# EAGLE design panel-mount-orafice-mk-1 (EAGLE 6.5.0)
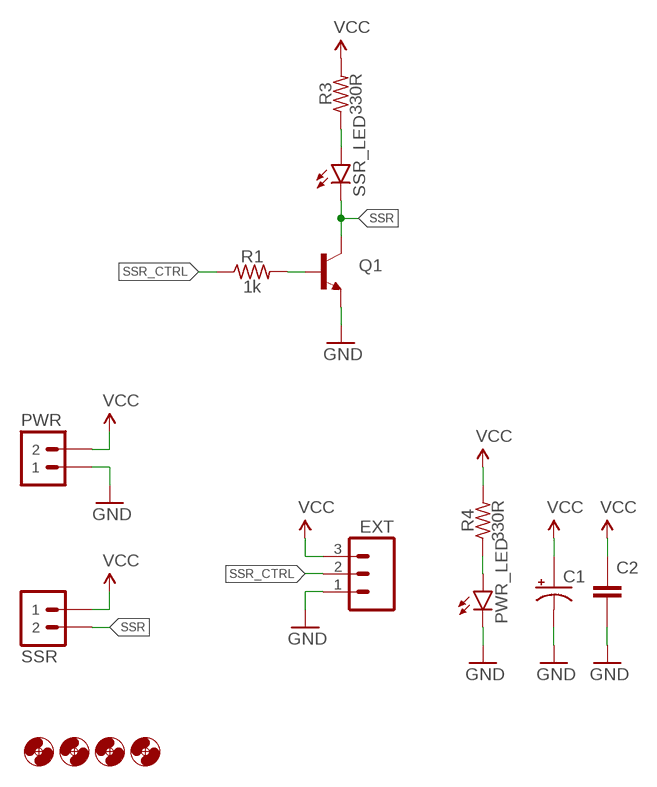
[diagram p0: schematic, sheet 1]

## Parts
C1  CAPACITOR-POLARIZEDE3.5-8  [E3,5-8]
C2  CAPACITOR-CERAMIC025-024X044  [C025-024X044]
EXT  M03JST-XH-RA-PTH  [JST-3-XH-RA-PTH]
H1  HOLE#2  [HOLE-#2]
H2  HOLE#2  [HOLE-#2]
H3  HOLE#2  [HOLE-#2]
H4  HOLE#2  [HOLE-#2]
PWR  M02JST-PTH-VERT  [JST-2-PH-VERT-PTH]
PWR_LED  LED3MM  [LED3MM]
Q1  TRANSISTOR_NPNTO-92-AMMO-EBC  [TO-92-AMMO]
R1  1k  RESISTORPTH-AXIAL-6.35MM  [RESISTOR-AXIAL-PTH-6.35MM]
R3  330R  RESISTORPTH-AXIAL-6.35MM  [RESISTOR-AXIAL-PTH-6.35MM]
R4  330R  RESISTORPTH-AXIAL-6.35MM  [RESISTOR-AXIAL-PTH-6.35MM]
SSR  M02JST-PTH-VERT  [JST-2-PH-VERT-PTH]
SSR_LED  LED3MM  [LED3MM]

## Nets
GND: C1.- C2.2 EXT.1 PWR.1 PWR_LED.K(C) Q1.1(E)
N$1: Q1.2(B) R1.P$2
N$4: R3.P$1 SSR_LED.A
N$5: PWR_LED.A R4.P$1
SSR: Q1.3(C) SSR.2 SSR_LED.K(C)
SSR_CTRL: EXT.2 R1.P$1
VCC: C1.+ C2.1 EXT.3 PWR.2 R3.P$2 R4.P$2 SSR.1

## Library data of the parts
C1 = A_butts:CAPACITOR-POLARIZED: POLARIZED CAPACITOR, American symbol
C2 = A_butts:CAPACITOR-CERAMIC: CAPACITOR, European symbol
EXT = A_butts:M03: Header 3 Standard 3-pin 0.1" header. Use with straight break away headers (SKU : PRT-00116), right angle break away headers (PRT-00553), swiss pins (PRT-00743), machine pins (PRT-00117), and female headers (PRT-00115). Molex polarized connector foot print use with SKU : PRT-08232 with associated crimp pins and housings.
H1-H4 = A_butts:HOLE: MOUNTING HOLE with drill center marker
PWR SSR = A_butts:M02: Standard 2-pin 0.1" header. Use with - straight break away headers ( PRT-00116) - right angle break away headers (PRT-00553) - swiss pins (PRT-00743) - machine pins (PRT-00117) - female headers (PRT-00115) Molex polarized connector foot print use with: PRT-08233 with associated crimp pins and housings. 2.54_SCREWTERM for use with PRT-10571. 3.5mm Screw Terminal footprints for PRT-08084 5mm Screw Terminal footprints for use with PRT-08433
PWR_LED SSR_LED = A_butts:LED: LEDs Standard schematic elements and footprints for 5mm, 3mm, 1206, and 0603 sized LEDs. 5mm - Spark Fun Electronics SKU : COM-00529 (and others)
Q1 = A_butts:TRANSISTOR_NPN: Generic NPN BJT MMBT2222A - TRANS-08049 (SOT-23, 1A 40V) MPSA42 - TRANS-09116 (SOT-23, 500mA 300V) MMBT5088LT1G - TRANS-11160 (SOT-23, 50 mA 30V) BC547 - COM-08928 <http://www.sparkfun.com/products/8928> (TO-92 45V 100mA) (1.Collector 2.Base 3.Emitter) 2N3904 - COM-00521 <http://www.sparkfun.com/products/521> (TO-92 40V 200mA) (1.Emitter 2.Base 3.Collector) P2N2222A - COM-12852 <http://www.sparkfun.com/products/12852> (TO-92 40V 600mA) (1.Collector 2.Base 3.Emitter)
R1 R3 R4 = A_butts:RESISTOR: RESISTOR, American symbol

## Board
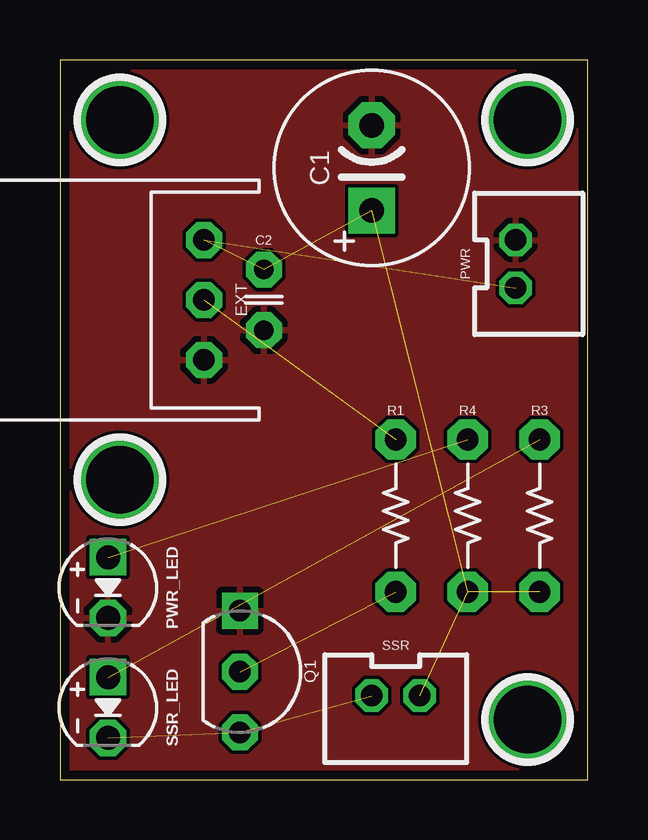
[diagram p1: board, top side]
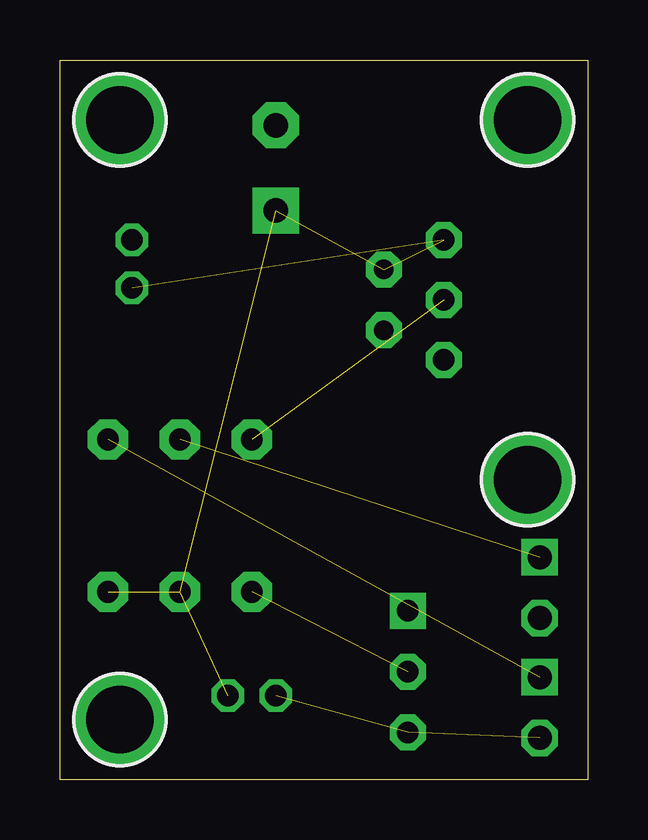
[diagram p2: board, bottom side, seen from below]

Size 22 x 30 mm. Coordinates in mm from the lower left corner, seen from the top.
Outline: 0,0 22,0 22,30 0,30 0,0
Copper layers (1*16): Top 0.0356mm / dielectric 1.5011mm / Bottom 0.0356mm
Design rules "LaenPCBOrder_2": minimum track width 6mil, minimum drill 13mil, track to track 6mil, track to pad 6mil, pad to pad 6mil, via to via 6mil, smd to smd 6mil, copper to edge 15mil, drill to drill 6mil, minimum pad ring 7mil, minimum via ring 7mil, stop-mask expansion 3mil, vias tented up to drill 20mil, thermal gap 10mil

### Footprints (pad centres in the part's own frame; a part is rotated, then mirrored left to right if it is on the bottom)
E3,5-8 = drill 1.016 pad 1.93 square: + -1.778,0 | drill 1.016 pad 1.93 octagon: - 1.778,0
C025-024X044 = drill 0.813 pad 1.5 octagon: 1 -1.27,0; 2 1.27,0
JST-3-XH-RA-PTH = drill 0.9 pad 1.5 octagon: 1 -2.5,0; 2 0,0; 3 2.5,0
HOLE-#2 = drill 2.8 pad 3.81: P$1 0,0
JST-2-PH-VERT-PTH = drill 0.9 octagon: 1 -1,0; 2 1,0
LED3MM = drill 1 pad 1.524 square: A -1.27,0 | drill 1 pad 1.524 octagon: K 1.27,0
TO-92-AMMO = drill 0.9 pad 1.5 square: 1 -2.54,0 | drill 0.9 pad 1.5 octagon: 2 0,0; 3 2.54,0
RESISTOR-AXIAL-PTH-6.35MM = drill 0.9 pad 1.676 octagon: P$1 -3.175,0; P$2 3.175,0

### Placement (x,y rotation side)
C1  13,25.5 90 top
C2  8.5,20 270 top
EXT  6,20 90 top
H1  2.5,27.5 0 top
H2  2.5,12.5 0 top
H3  19.5,27.5 0 top
H4  19.5,2.5 0 top
PWR  19,21.5 270 top
PWR_LED  2,8 270 top
Q1  7.5,4.5 270 top
R1  14,11 270 top
R3  20,11 270 top
R4  17,11 270 top
SSR  14,3.5 180 top
SSR_LED  2,3 270 top

### Tracks (layer width: path | path; a pad name or v marks a point on that pad's centre or on a via)
GND
  pour Top: 0,0 0,30 22,30 22,0
N$1  (1 unrouted)
N$4  (1 unrouted)
N$5  (1 unrouted)
SSR  (2 unrouted)
SSR_CTRL  (1 unrouted)
VCC  (6 unrouted)